# EAGLE design convrs485 (EAGLE 4.09)
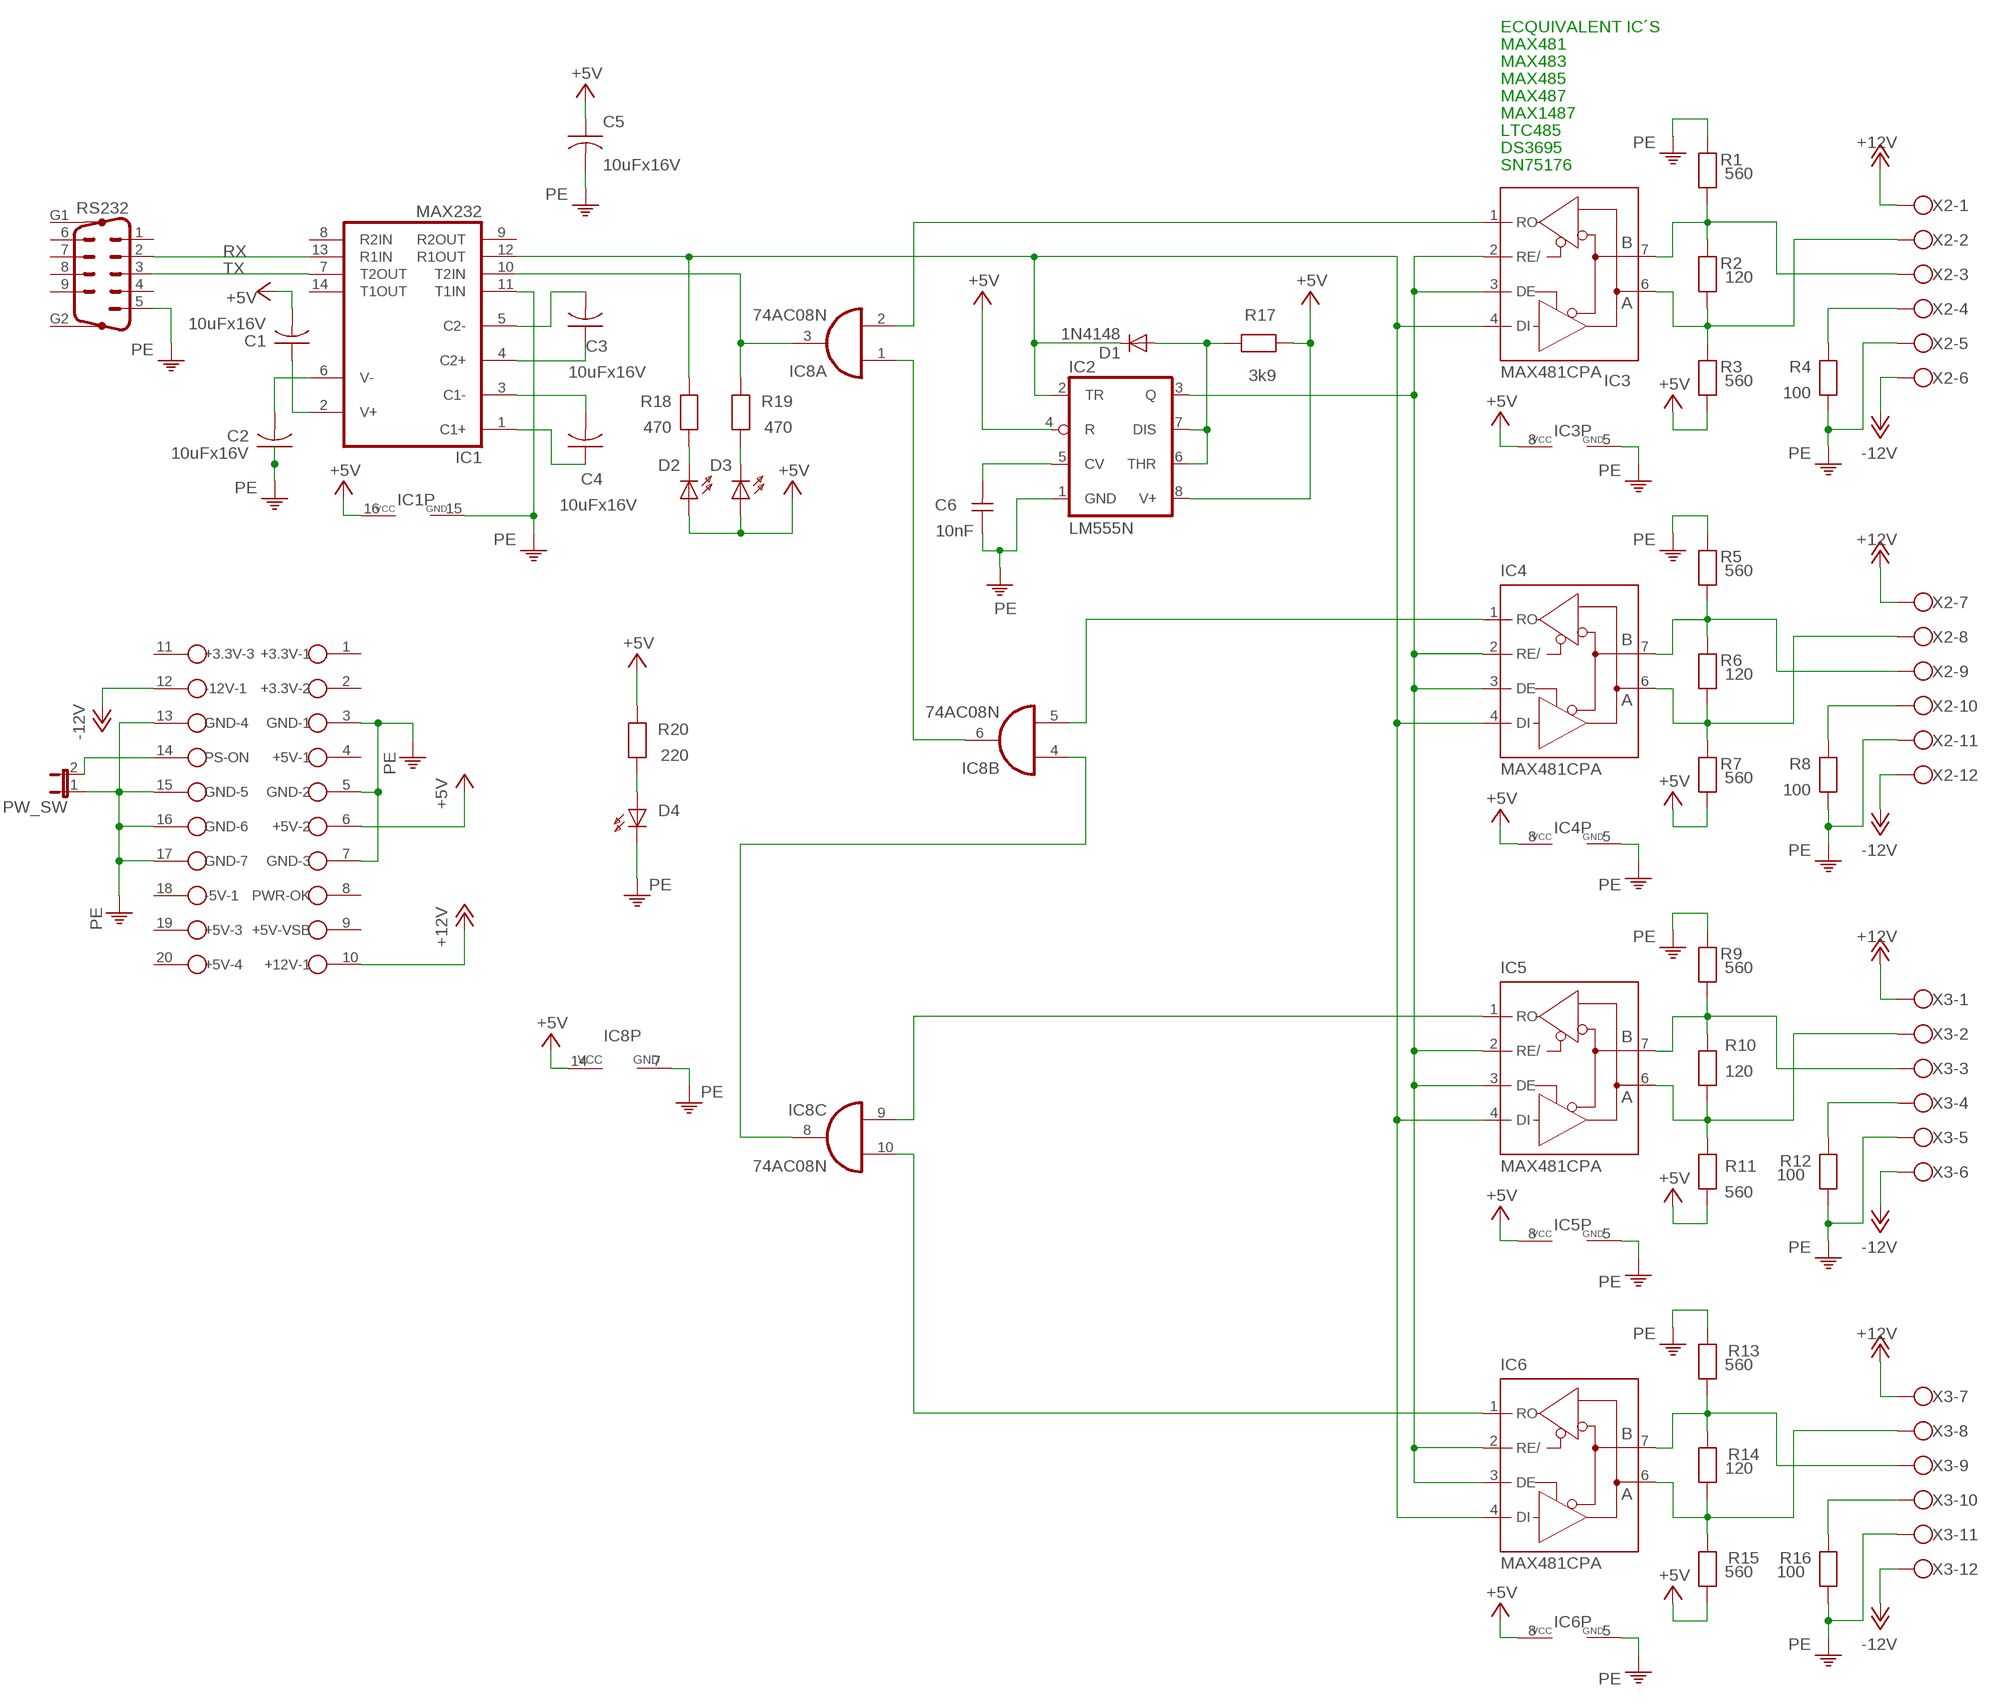
[diagram p0: schematic, sheet 1]

## Parts
C1  10uFx16V  CAP-2,5  [C-2,5]
C2  10uFx16V  CAP-2,5  [C-2,5]
C3  10uFx16V  CAP-2,5  [C-2,5]
C4  10uFx16V  CAP-2,5  [C-2,5]
C5  10uFx16V  CAP-2,5  [C-2,5]
C6  10nF  CAPNP-5  [C-5]
D1  1N4148  [DO35-10]
D2  LED3MM  [LED3MM]
D3  LED3MM  [LED3MM]
D4  LED3MM  [LED3MM]
IC1  MAX232  [DIL16]
IC2  LM555N  [DIL08]
IC3  MAX481CPA  [DIL08]
IC4  MAX481CPA  [DIL08]
IC5  MAX481CPA  [DIL08]
IC6  MAX481CPA  [DIL08]
IC8  74AC08N  [DIL14]
PW_SW  JP1E  [JP1]
R1  560  RESEU-7,5  [R-7,5]
R2  120  RESEU-7,5  [R-7,5]
R3  560  RESEU-7,5  [R-7,5]
R4  100  RESEU-7,5  [R-7,5]
R5  560  RESEU-7,5  [R-7,5]
R6  120  RESEU-7,5  [R-7,5]
R7  560  RESEU-7,5  [R-7,5]
R8  100  RESEU-7,5  [R-7,5]
R9  560  RESEU-7,5  [R-7,5]
R10  120  RESEU-7,5  [R-7,5]
R11  560  RESEU-7,5  [R-7,5]
R12  100  RESEU-7,5  [R-7,5]
R13  560  RESEU-7,5  [R-7,5]
R14  120  RESEU-7,5  [R-7,5]
R15  560  RESEU-7,5  [R-7,5]
R16  100  RESEU-7,5  [R-7,5]
R17  3k9  RESEU-7,5  [R-7,5]
R18  470  RESEU-10  [R-10]
R19  470  RESEU-10  [R-10]
R20  220  RESEU-10  [R-10]
RS232  M09HP  [M09HP]
U$1  CONECTOR_ATX  [CONECTOR_ATX]
X2  AK500/12  [AK500/12]
X3  AK500/12  [AK500/12]

## Nets
+5V: C1.2 C5.1 D2.A D3.A IC1.16(VCC) IC2.4(R) IC2.8(V+) IC3.8(VCC) IC4.8(VCC) IC5.8(VCC) IC6.8(VCC) IC8.14(P:VCC) R3.1 R7.1 R11.1 R15.1 R17.1 R20.2 U$1.6(+5V-2)
+12V: U$1.10(+12V-1) X2.1 X2.7 X3.1 X3.7
-12V: U$1.12(-12V-1) X2.6 X2.12 X3.6 X3.12
A1: IC6.6(A) R14.1 R15.2 X3.8
A2: IC5.6(A) R10.1 R11.2 X3.2
A3: IC4.6(A) R6.1 R7.2 X2.8
A4: IC3.6(A) R2.1 R3.2 X2.2
B1: IC6.7(B) R13.1 R14.2 X3.9
B2: IC5.7(B) R9.1 R10.2 X3.3
B3: IC4.7(B) R5.1 R6.2 X2.9
B4: IC3.7(B) R1.1 R2.2 X2.3
N$1: C3.2 IC1.5(C2-)
N$2: C3.1 IC1.4(C2+)
N$3: C4.2 IC1.3(C1-)
N$4: C1.1 IC1.2(V+)
N$5: C2.2 IC1.6(V-)
N$6: C4.1 IC1.1(C1+)
N$7: R8.1 X2.10
N$8: R16.1 X3.10
N$9: IC3.1(RO) IC8.2(A:I1)
N$10: PW_SW.2 U$1.14(PS-ON)
N$11: IC2.3(Q) IC3.2(RE/) IC3.3(DE) IC4.2(RE/) IC4.3(DE) IC5.2(RE/) IC5.3(DE) IC6.2(RE/) IC6.3(DE)
N$12: IC5.1(RO) IC8.9(C:I0)
N$13: IC4.1(RO) IC8.5(B:I1)
N$14: IC6.1(RO) IC8.10(C:I1)
N$15: IC8.4(B:I0) IC8.8(C:O)
N$16: IC8.1(A:I0) IC8.6(B:O)
N$17: IC1.10(T2IN) IC8.3(A:O) R19.2
N$19: D2.K(C) R18.1
N$20: D3.K(C) R19.1
N$21: D4.A R20.1
N$23: C6.2 IC2.5(CV)
N$27: D1.C IC1.12(R1OUT) IC2.2(TR) IC3.4(DI) IC4.4(DI) IC5.4(DI) IC6.4(DI) R18.2
N$32: D1.A IC2.6(THR) IC2.7(DIS) R17.2
N$35: R12.1 X3.4
N$36: R4.1 X2.4
PE: C2.1 C5.2 C6.1 D4.K(C) IC1.11(T1IN) IC1.15(GND) IC2.1(GND) IC3.5(GND) IC4.5(GND) IC5.5(GND) IC6.5(GND) IC8.7(P:GND) PW_SW.1 R1.2 R4.2 R5.2 R8.2 R9.2 R12.2 R13.2 R16.2 RS232.5 U$1.3(GND-1) U$1.5(GND-2) U$1.7(GND-3) U$1.13(GND-4) U$1.15(GND-5) U$1.16(GND-6) U$1.17(GND-7) X2.5 X2.11 X3.5 X3.11
RX: IC1.13(R1IN) RS232.2
TX: IC1.7(T2OUT) RS232.3
Unconnected: IC1.8(R2IN) IC1.9(R2OUT) IC1.14(T1OUT) IC8.11(D:O) IC8.12(D:I0) IC8.13(D:I1) RS232.1 RS232.4 RS232.6 RS232.7 RS232.8 RS232.9 RS232.G1 RS232.G2 U$1.18(-5V-1)

## Notes on the sheet
- ECQUIVALENT IC´S
- MAX481
- MAX483
- MAX485
- MAX487
- MAX1487
- LTC485
- DS3695
- SN75176

## Power pins joined to a net without a drawn wire
+3.3V-1: U$1.1(+3.3V-1)
+3.3V-2: U$1.2(+3.3V-2)
+3.3V-3: U$1.11(+3.3V-3)
+5V-1: U$1.4(+5V-1)
+5V-3: U$1.19(+5V-3)
+5V-4: U$1.20(+5V-4)
+5V-VSB: U$1.9(+5V-VSB)
PWR-OK: U$1.8(PWR-OK)

## Library data of the parts
C1-C5 = discrete:CAP-2,5
C6 = discrete:CAPNP-5
D1 = diode:1N4148: DIODE high speed (Philips)
D2-D4 = led:LED: LED
IC1 = maxim:MAX232: RS232 TRANSEIVER
IC2 = linear:*555: TIMER
IC3-IC6 = maxim:MAX481CPA: RS485 TRANSEIVER
IC8 = 74xx-eu:74*08: Quad 2-input AND gate
PW_SW = jumper:JP1E: JUMPER
R1-R17 = discrete:RESEU-7,5
R18-R20 = discrete:RESEU-10
RS232 = con-subd:M09HP: SUB-D
U$1 = conector:CONECTOR_ATX
X2 X3 = con-ptr500:AK500/12: CONNECTOR

## Board
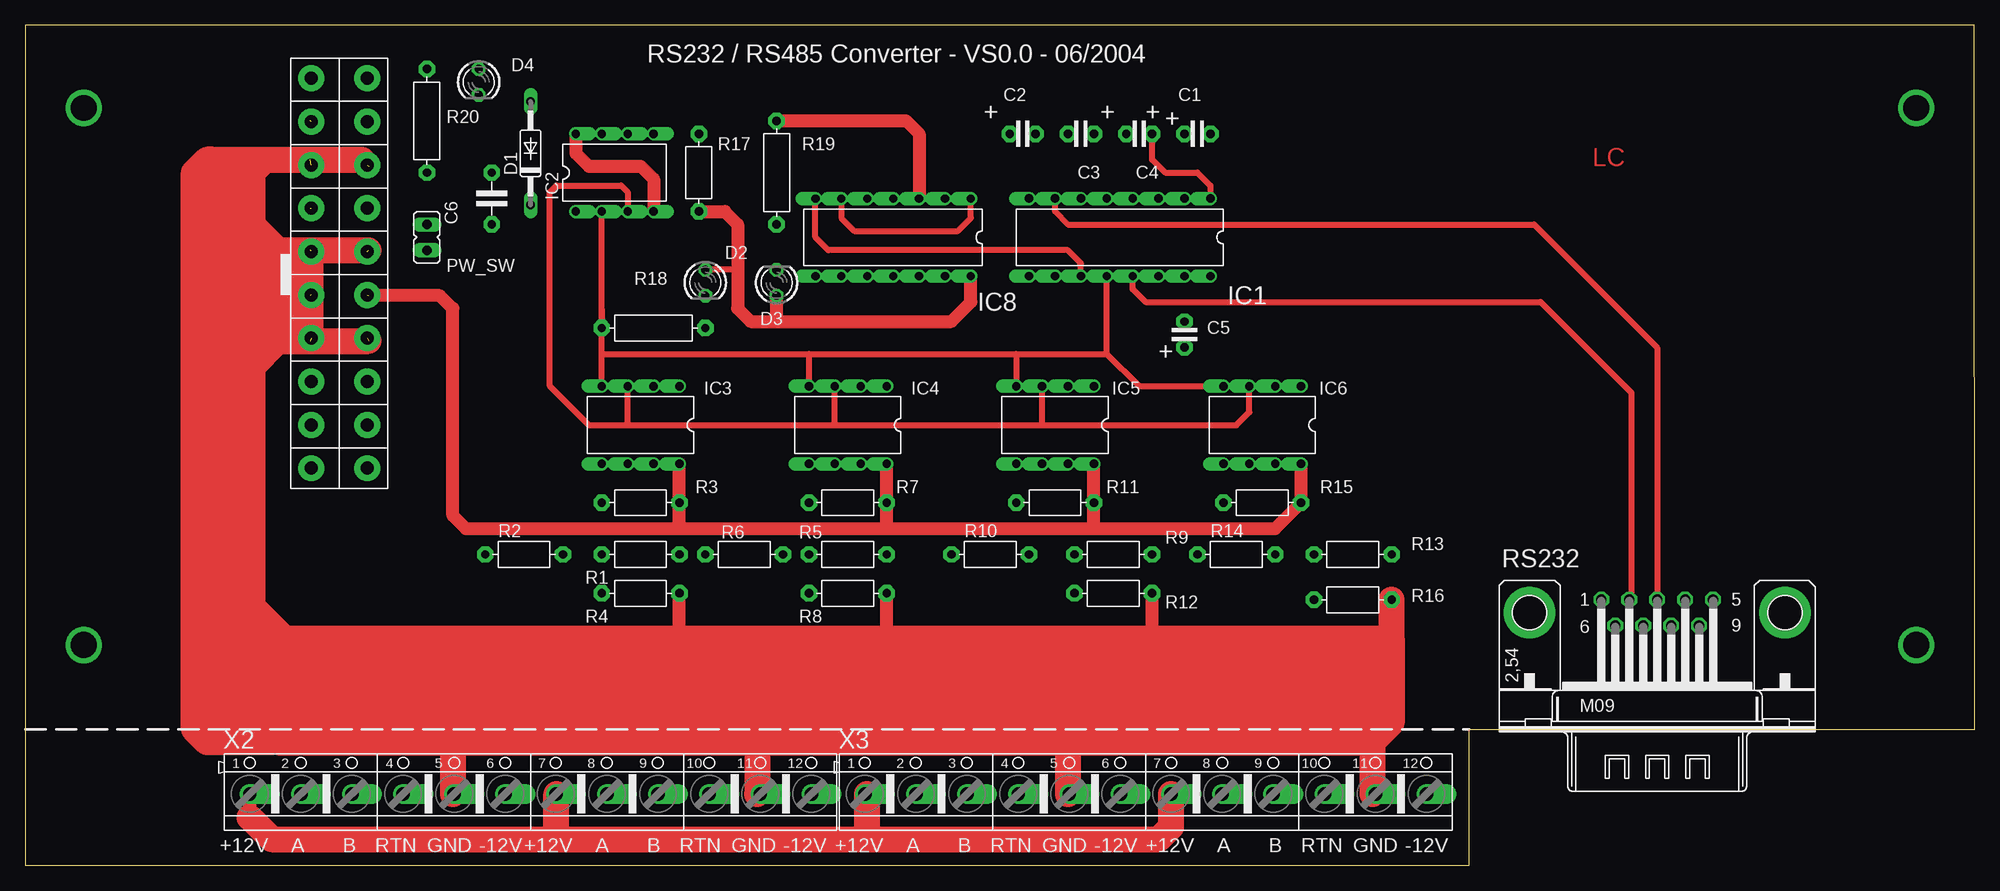
[diagram p1: board, top side]
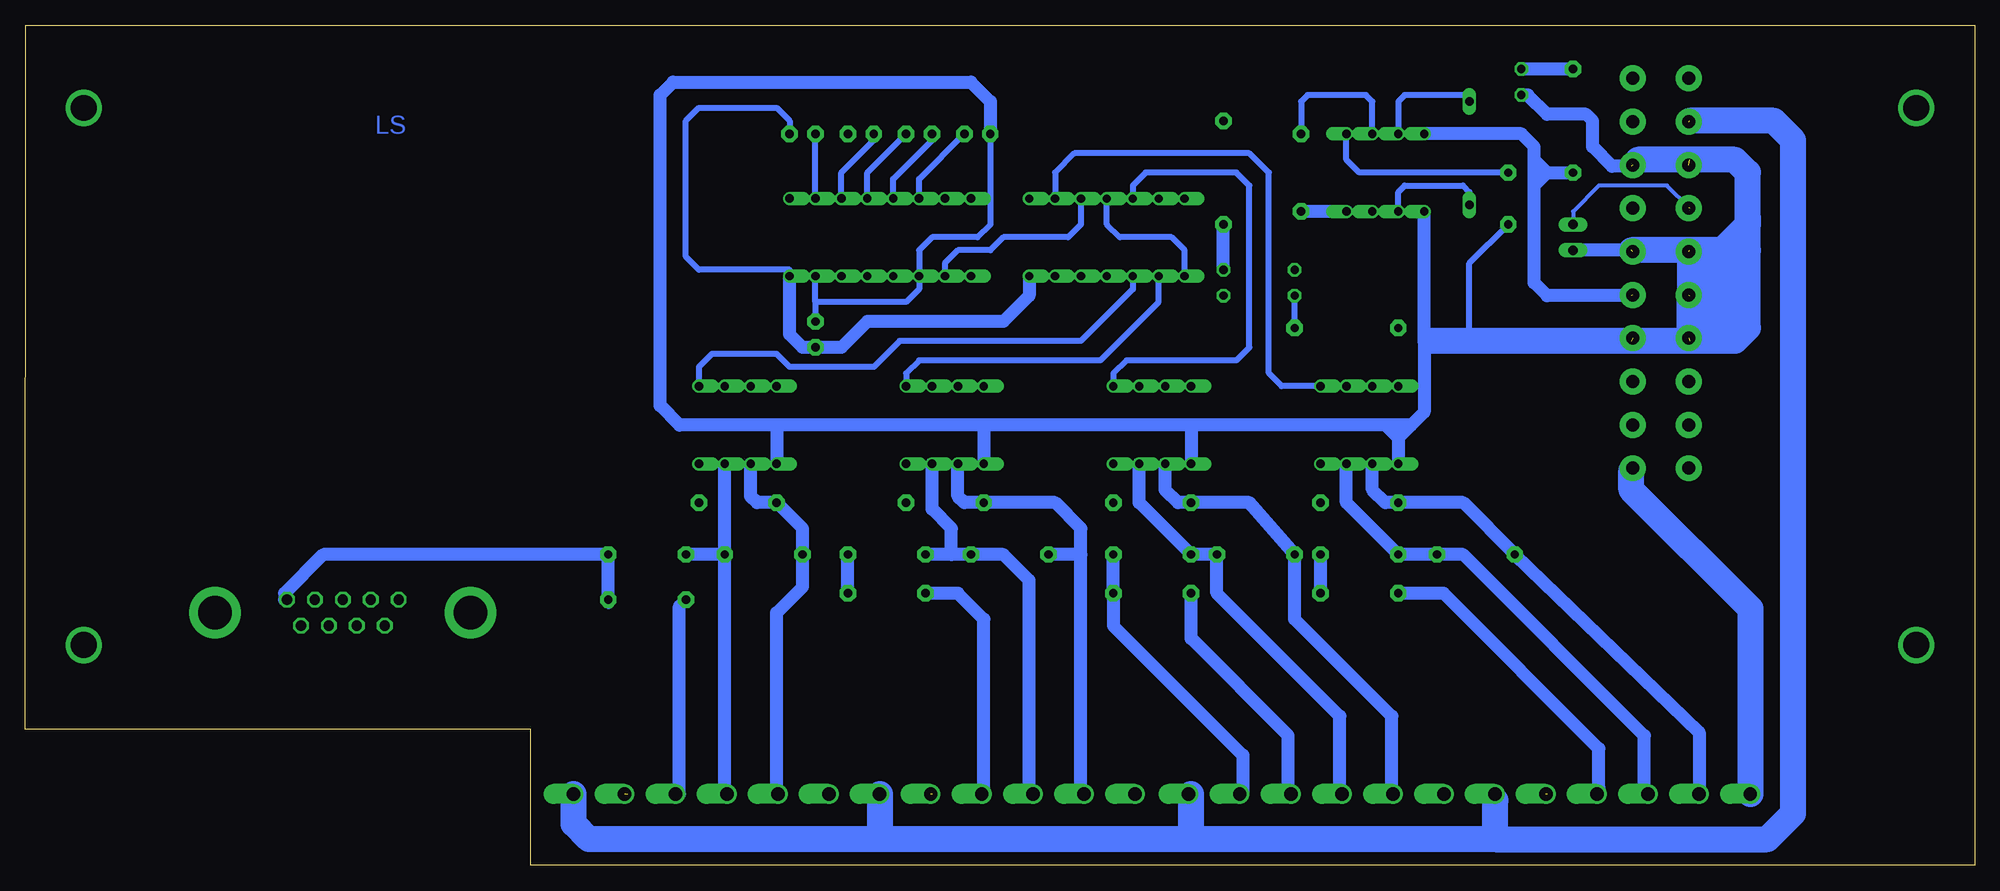
[diagram p2: board, bottom side, seen from below]

Size 191.13 x 82.38 mm. Coordinates in mm from the lower left corner, seen from the top.
Outline: 0,0 141.58,0 141.58,12.68 141.6,13.33 191.13,13.33 191.12,82.38 0,82.38 0,0
Copper layers used: Top, Bottom

### Footprints (pad centres in the part's own frame; a part is rotated, then mirrored left to right if it is on the bottom)
C-2,5 = drill 0.813 pad 1.6 octagon: 1 -1.27,0; 2 1.27,0
C-5 = drill 0.813 pad 1.6 octagon: 1 -2.54,0; 2 2.54,0
DO35-10 = drill 0.813 long: A 5.08,0; C -5.08,0
LED3MM = drill 0.813 octagon: A -1.27,0; K 1.27,0
DIL16 = drill 0.813 offset: 1 -8.89,-3.81; 2 -6.35,-3.81; 3 -3.81,-3.81; 4 -1.27,-3.81; 5 1.27,-3.81; 6 3.81,-3.81; 7 6.35,-3.81; 8 8.89,-3.81; 9 8.89,3.81; 10 6.35,3.81; 11 3.81,3.81; 12 1.27,3.81; 13 -1.27,3.81; 14 -3.81,3.81; 15 -6.35,3.81; 16 -8.89,3.81
DIL08 = drill 0.813 offset: 1 -3.81,-3.81; 2 -1.27,-3.81; 3 1.27,-3.81; 4 3.81,-3.81; 5 3.81,3.81; 6 1.27,3.81; 7 -1.27,3.81; 8 -3.81,3.81
DIL14 = drill 0.8 offset: 1 -7.62,-3.81; 2 -5.08,-3.81; 3 -2.54,-3.81; 4 0,-3.81; 5 2.54,-3.81; 6 5.08,-3.81; 7 7.62,-3.81; 8 7.62,3.81; 9 5.08,3.81; 10 2.54,3.81; 11 0,3.81; 12 -2.54,3.81; 13 -5.08,3.81; 14 -7.62,3.81
JP1 = drill 0.914 long: 1 0,-1.27; 2 0,1.27
R-7,5 = drill 0.813 pad 1.6 octagon: 1 -3.81,0; 2 3.81,0
R-10 = drill 0.813 pad 1.6 octagon: 1 -5.08,0; 2 5.08,0
M09HP = drill 1.016 octagon: 1 -5.486,1.27; 2 -2.743,1.27; 3 0,1.27; 4 2.743,1.27; 5 5.486,1.27; 6 -4.115,-1.27; 7 -1.372,-1.27; 8 1.372,-1.27; 9 4.115,-1.27 | drill 3.302 pad 5.08 round: G1 -12.522,0; G2 12.522,0
CONECTOR_ATX = drill 1.27 pad 2.54 round: 1 -9.25,0.5; 2 -5,0.5; 3 -0.75,0.5; 4 3.5,0.5; 5 7.75,0.5; 6 12,0.5; 7 16.25,0.5; 8 20.5,0.5; 9 24.75,0.5; 10 29,0.5; 11 -9.25,-5; 12 -5,-5; 13 -0.75,-5; 14 3.5,-5; 15 7.75,-5; 16 12,-5; 17 16.25,-5; 18 20.5,-5; 19 24.75,-5; 20 29,-5
AK500/12 = drill 1.321 offset: 1 -27.534,0; 2 -22.53,0; 3 -17.526,0; 4 -12.497,0; 5 -7.493,0; 6 -2.489,0; 7 2.489,0; 8 7.493,0; 9 12.497,0; 10 17.526,0; 11 22.53,0; 12 27.534,0

### Placement (x,y rotation side)
C1  114.93,71.75 0 top
C2  97.78,71.75 0 top
C3  103.5,71.75 180 top
C4  109.22,71.75 180 top
C5  113.66,52.06 90 top
C6  45.71,65.4 90 top
D1  49.52,69.84 90 top
D2  66.67,57.14 270 top
D3  73.66,57.14 90 top
D4  44.44,76.83 270 top
IC1  107.31,61.59 180 top
IC2  57.78,67.94 0 top
IC3  60.32,43.17 180 top
IC4  80.64,43.17 180 top
IC5  100.96,43.17 180 top
IC6  121.28,43.17 180 top
IC8  85.08,61.59 180 top
PW_SW  39.36,61.59 0 top
R1  60.32,30.47 0 top
R2  48.89,30.47 0 top
R3  60.32,35.55 180 top
R4  60.32,26.66 0 top
R5  80.64,30.47 0 top
R6  70.48,30.47 0 top
R7  80.64,35.55 180 top
R8  80.64,26.66 0 top
R9  106.67,30.47 0 top
R10  94.61,30.47 0 top
R11  100.96,35.55 180 top
R12  106.67,26.66 0 top
R13  130.17,30.47 0 top
R14  118.74,30.47 0 top
R15  121.28,35.55 180 top
R16  130.17,26.03 0 top
R17  66.03,67.94 90 top
R18  61.59,52.7 180 top
R19  73.66,67.94 90 top
R20  39.36,73.02 270 top
RS232  160.01,24.76 0 top
U$1  33.02,67.94 270 top
X2  49.52,6.98 0 top
X3  109.85,6.98 0 top

### Tracks (layer width: path | path; a pad name or v marks a point on that pad's centre or on a via)
+5V  (via drill 0.61)  (1 unrouted)
  Top 0.61: 69.84,58.41 D2.A
  Top 1.27: IC8.14 92.7,55.24 90.8,53.33 73.66,53.33 | 84.45,33.01 R7.1 IC4.8 | 84.45,33.01 104.77,33.01 | 104.77,33.01 122.55,33.01 R15.1 IC6.8 | 104.77,33.01 R11.1 IC5.8 | IC3.8 R3.1 64.13,33.01 | 64.13,33.01 84.45,33.01 | IC2.8 53.97,69.84 55.24,68.57 60.32,68.57 61.59,67.3 IC2.4 | 73.66,53.33 71.11,53.33 69.84,54.6 69.84,58.41 69.84,62.86 68.57,64.13 R17.1 | 64.13,33.01 43.17,33.01 41.9,34.28 41.9,54.6 40.63,55.87 v33.65,55.87 | 73.66,53.33 D3.A
  Bottom 0.61: C1.2 116.2,73.02 117.47,74.29 125.09,74.29 126.36,73.02 126.36,59.68 125.09,58.41 116.2,58.41 IC1.16
  Bottom 1.27: IC1.16 116.2,52.06 114.93,50.79 C5.1 111.12,50.79 108.58,53.33 95.25,53.33 92.7,55.87 IC8.14 | IC2.4 R17.1 | IC2.8 44.44,71.75 43.17,70.48 43.17,69.21 | 43.17,67.94 43.17,69.21 | 41.9,67.94 R20.2 | 43.17,67.94 41.9,67.94 | v33.65,55.87 41.9,55.87 43.17,57.14 43.17,66.67 | 43.17,66.67 43.17,67.94 | 43.17,66.67 41.9,67.94 | 41.9,67.94 43.17,69.21
+12V
  Top 0.61: 82.54,6.98 X3.1 82.32,5.3 82.54,2.53 | 52.06,6.98 X2.7
  Top 1.27: 82.54,2.53 82.54,4.44 | X2.1 21.99,4.67
  Top 2.54: X3.7 112.34,3.75 111.12,2.53 82.54,2.53 | 82.54,2.53 82.54,6.98 | 52.06,2.53 82.54,2.53 | 21.99,4.67 24.12,2.53 52.06,2.53 | 52.06,2.53 52.06,6.98
  Bottom 0.61: 33.52,38.86 U$1.10
  Bottom 1.27: 33.65,38.73 33.52,38.86
  Bottom 2.54: X2.1 21.99,25.16 33.65,36.82 33.65,38.73
-12V  (1 unrouted)
  Bottom 0.61: 107.31,6.98 X3.6 | 76.83,6.98 X2.12 | 46.98,6.34 X2.6
  Bottom 2.54: X3.12 137.38,4.03 135.88,2.53 107.31,2.53 | 46.98,2.53 76.83,2.53 | 76.83,2.53 107.31,2.53 | 46.98,2.53 46.98,6.34 | 76.83,2.53 76.83,6.98 | 46.98,2.53 20.31,2.53 17.77,5.07 17.77,71.11 19.68,73.02 27.93,73.02 | 107.31,2.53 107.31,6.98
A1
  Bottom 0.61: X3.8 117.47,6.98
  Bottom 1.27: IC6.6 120.01,36.19 119.38,35.55 R15.2 114.93,33.01 R14.1 114.93,27.3 117.47,24.76 117.47,6.98
A2
  Bottom 0.61: X3.2 87.62,6.98
  Bottom 1.27: IC5.6 99.69,36.19 99.06,35.55 R11.2 90.16,35.55 87.62,33.01 87.62,30.47 | 87.62,6.98 87.62,30.47 | 87.62,30.47 R10.1
A3
  Bottom 0.61: X2.8 57.14,6.98
  Bottom 1.27: IC4.6 79.37,36.82 78.1,35.55 R7.2 71.11,35.55 R6.1 66.67,24.12 57.14,14.6 57.14,6.98
A4
  Bottom 1.27: IC3.6 59.05,36.82 57.78,35.55 R3.2 50.16,35.55 R2.1 26.99,13.02 X2.2
B1
  Bottom 0.61: X3.9 122.55,6.98
  Bottom 1.27: R14.2 R13.1 | R14.2 IC6.7 | 122.55,6.98 R14.2
B2
  Bottom 0.61: X3.3 92.07,6.98 92.7,7.61
  Bottom 1.27: 100.32,30.47 R9.1 | 100.32,30.47 100.32,33.01 102.23,34.92 IC5.7 | 100.32,30.47 R10.2 95.25,30.47 92.7,27.93 92.7,7.61
B3
  Bottom 0.61: X2.9 62.22,6.98
  Bottom 1.27: IC4.7 81.91,35.55 R5.1 R6.2 74.29,26.66 62.22,14.6 62.22,6.98
B4
  Bottom 0.61: X2.3 31.74,6.98 32.38,7.61
  Bottom 1.27: IC3.7 61.59,35.55 R1.1 R2.2 50.16,30.47 32.38,12.69 32.38,7.61
N$1
  Bottom 0.61: C3.2 102.23,71.11 106.04,67.3 IC1.5
N$2
  Bottom 0.61: C3.1 108.58,67.94 IC1.4
N$3
  Bottom 0.61: C4.2 107.94,71.11 111.12,67.94 IC1.3
N$4
  Bottom 0.61: IC1.2 C1.1
N$5
  Bottom 0.61: C2.2 103.5,67.3 IC1.6
N$6
  Top 0.61: C4.1 110.48,69.21 111.75,67.94 114.93,67.94 116.2,66.67 IC1.1
N$7
  Bottom 0.61: X2.10 67.3,6.98
  Bottom 1.27: 67.3,6.98 67.3,12.69 76.83,22.22 R8.1
N$8
  Bottom 0.61: X3.10 126.99,6.98
  Bottom 1.27: R16.1 126.99,25.39 126.99,6.98
N$9
  Bottom 0.61: IC3.1 67.94,46.98 69.21,48.25 69.21,67.94 71.11,69.84 88.26,69.84 90.16,67.94 IC8.2
N$10  (1 unrouted)
  Bottom 0.406: 27.93,64.45 30.16,66.67 36.82,66.67 39.36,64.13 PW_SW.2
N$11
  Top 0.61: 79.37,43.17 99.69,43.17 | 99.69,43.17 118.74,43.17 120.01,44.44 IC6.3 IC6.2 | 99.69,43.17 IC5.3 IC5.2 | 79.37,43.17 IC4.3 IC4.2 | 59.05,43.17 79.37,43.17 | IC3.2 IC3.3 59.05,43.17 | 59.05,43.17 55.24,43.17 51.43,46.98 51.43,66.03 52.06,66.67 58.41,66.67 59.05,66.03 IC2.3
N$12
  Bottom 0.61: IC5.1 104.77,48.25 103.5,49.52 85.72,49.52 80,55.24 IC8.9
N$13
  Bottom 0.61: IC4.1 84.45,48.25 83.18,49.52 72.38,49.52 71.11,50.79 71.11,66.67 72.38,67.94 81.27,67.94 82.54,66.67 IC8.5
N$14
  Bottom 0.61: IC6.1 125.09,48.89 123.82,50.16 117.47,50.16 116.2,48.89 107.94,48.89 105.41,51.43 87.62,51.43 82.54,56.51 IC8.10
N$15
  Bottom 0.61: IC8.8 77.47,60.32 78.73,61.59 83.81,61.59 85.08,62.86 IC8.4
N$16
  Top 0.61: IC8.6 80,63.49 81.27,62.22 91.44,62.22 92.7,63.49 IC8.1
N$17
  Top 1.27: R19.2 86.35,73.02 87.62,71.75 IC8.3
  Bottom 0.61: IC1.10 100.96,59.05 99.69,60.32 96.51,60.32 95.25,61.59 88.89,61.59 87.62,62.86 IC8.3
N$18
  Bottom 2.54: 26.03,52.06 26.03,59.68
N$19
  Bottom 0.61: R18.1 D2.K
N$20
  Bottom 1.27: D3.K R19.1
N$21
  Bottom 1.27: R20.1 D4.A
N$22
  Top 2.54: 24.12,52.7 24.12,59.68
N$23
  Bottom 0.61: C6.2 60.32,67.94 61.59,69.21 IC2.5
N$24  (via drill 2.54)
  other vias: 5.71,74.29
N$25
  Top 2.54: 26.03,52.06 26.03,59.68
N$27
  Top 0.61: IC3.4 56.51,50.16 | 56.51,50.16 76.83,50.16 | 76.83,50.16 97.15,50.16 | 97.15,50.16 106.04,50.16 | 106.04,50.16 109.22,46.98 IC6.4 | 97.15,50.16 IC5.4 | 76.83,50.16 IC4.4 | 106.04,50.16 IC1.12 | 56.51,50.16 56.51,54.6 | 56.51,54.6 IC2.2 | 56.51,54.6 R18.2
  Bottom 0.61: D1.C 49.52,66.03 50.16,66.67 55.88,66.67 56.51,66.03 IC2.2
N$28  (via drill 2.54)
  other vias: 185.41,74.29
N$29  (via drill 2.54)
  other vias: 185.41,21.58
N$30  (via drill 2.54)
  other vias: 5.71,21.58
N$32
  Bottom 0.61: D1.A 50.16,75.56 55.88,75.56 56.51,74.92 IC2.7 IC2.6 59.05,74.92 59.68,75.56 65.4,75.56 66.03,74.92 R17.2
N$35
  Bottom 1.27: R12.1 99.69,26.66 97.15,24.12 97.15,6.98 X3.4
N$36
  Bottom 0.61: X2.4 37.03,7.18 36.82,7.61
  Bottom 1.27: 36.82,7.61 36.82,11.42 52.06,26.66 R4.1
PE  (via drill 0.61)  (10 unrouted)
  Top 0.61: IC1.11 103.5,59.05 102.23,60.32 78.73,60.32 77.47,61.59 IC8.7
  Top 1.27: 110.48,22.22 R12.2 | 84.45,22.22 R8.2 | 64.13,22.22 R4.2 | 16.5,13.33 16.5,67.3 18.41,69.21 33.02,69.21 v33.65,68.57
  Top 2.54: 41.9,12.06 71.75,12.06 | 71.75,12.06 71.75,6.98 | 23.49,69.21 33.02,69.21 | 23.49,69.21 22.22,67.94 22.22,63.49 | 22.22,63.49 22.22,53.33 | 22.22,53.33 22.22,52.7 23.49,51.43 27.93,51.43 | 27.93,51.43 33.65,51.43 | 22.22,63.49 22.22,62.86 24.76,60.32 27.93,60.32 | 27.93,60.32 33.65,60.32 | 27.93,60.32 27.93,51.43 | 22.22,25.39 22.22,14.6 24.76,12.06 41.9,12.06 | 22.22,48.89 22.22,25.39 | 22.22,53.33 22.22,48.89 | 41.9,12.06 41.9,6.98 | 71.75,12.06 102.23,12.06 | 102.23,12.06 132.07,12.06 | 132.07,12.06 133.98,13.96 133.98,22.22 | 133.98,22.22 R16.2 | 132.07,12.06 132.07,6.98 | 102.23,12.06 102.23,6.98 | 133.98,22.22 110.48,22.22 84.45,22.22 64.13,22.22 25.39,22.22 22.22,25.39 | 23.49,69.21 18.41,69.21 17.77,69.21 16.5,67.94 16.5,13.33 17.77,12.06 24.12,12.06 | 27.93,51.43 24.76,51.43 22.22,48.89
  Bottom 0.61: 113.66,55.24 C5.2 | 113.66,55.24 IC1.15 | C2.1 96.51,62.86 97.78,61.59 102.23,61.59 103.5,60.32 IC1.11 103.5,56.51 104.77,55.24 113.66,55.24 | R16.2 133.98,25.39 | X3.5 102.23,6.98 | 71.75,6.98 X2.11 | 28.01,60.24 28.06,60.19 | C6.1 49.52,59.05 49.52,51.43
  Bottom 0.813: 27.93,60.32 28.01,60.24 | IC2.1 53.97,62.22
  Bottom 1.27: R16.2 R13.2 161.92,30.47 165.73,26.66 165.73,26.03 RS232.5 | 56.51,43.17 56.51,41.9 | 56.51,41.9 IC3.5 | 76.83,43.17 IC4.5 | 117.47,43.17 IC6.5 | 56.51,43.17 57.78,43.17 | 55.24,43.17 56.51,43.17 | 55.24,43.17 53.97,44.44 53.97,51.43 | 97.15,43.17 IC5.5 | R12.2 R9.2 | 71.75,6.98 71.75,10.79 84.45,23.49 R8.2 R5.2 | R4.2 R1.2 | 28.01,60.24 U$1.15 | 53.97,51.43 IC2.1 | 97.15,43.17 117.47,43.17 | 57.78,43.17 76.83,43.17 | 76.83,43.17 97.15,43.17 | 55.24,43.17 56.51,41.9 | 56.51,41.9 57.78,43.17 | 53.33,51.43 53.97,51.43 | 33.65,60.32 PW_SW.1 | C2.1 96.51,74.92 98.42,76.83 127.63,76.83 128.9,75.56 128.9,45.08 126.99,43.17 117.47,43.17 | D4.K 43.81,75.56 41.9,73.65 38.09,73.65 37.46,73.02 37.46,70.48 35.55,68.57 v33.65,68.57
  Bottom 2.54: 33.02,69.21 27.93,69.21 23.49,69.21 22.22,67.94 22.22,63.49 | 27.93,60.32 33.65,60.32 | 27.93,60.32 27.93,55.87 27.93,51.43 | 27.93,51.43 33.65,51.43 49.52,51.43 53.33,51.43 | 22.22,60.32 22.22,52.7 23.49,51.43 24.12,51.43 | 22.22,60.32 22.22,63.49 | 24.12,51.43 27.93,51.43 | 24.76,60.32 27.93,60.32 | 22.22,60.32 24.76,60.32 | 24.12,51.43 24.12,59.68 | 22.22,63.49 22.22,62.86 24.76,60.32
RX
  Top 0.61: IC1.13 108.58,56.51 109.85,55.24 148.58,55.24 157.47,46.35 157.47,26.03 RS232.2
TX
  Top 0.61: IC1.7 100.96,64.13 102.23,62.86 147.95,62.86 160.01,50.79 RS232.3
(copper drawn outside any net)
  shapes: Top area x2

### Text on the board
Top: LC
Bottom: LS
tPlace: RS232 / RS485 Converter - VS0.0 - 06/2004 | + | + | + | + | + | +12V | A | B | RTN | GND | -12V | +12V | A | B | RTN | GND | -12V | +12V | A | B | RTN | GND | -12V | +12V | A | B | RTN | GND | -12V